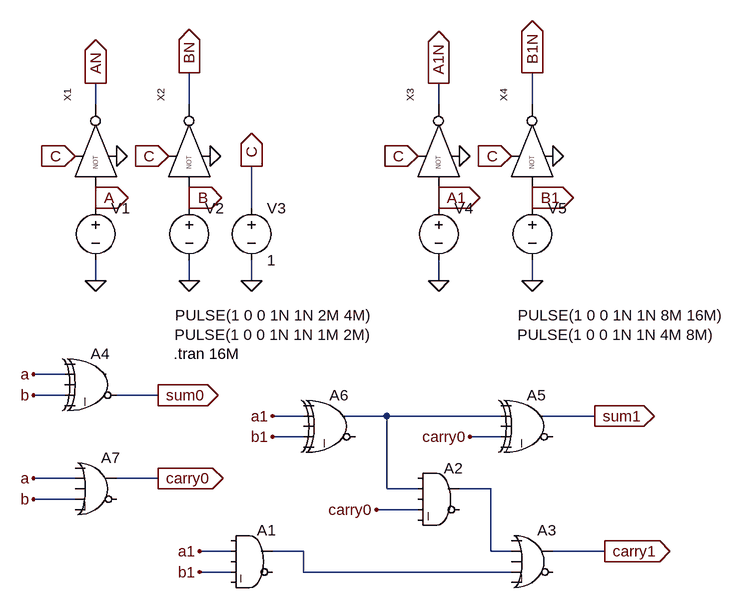
[diagram p0: schematic Draft41.asc]
Draft41.asc, the LTspice schematic file:
Version 4
SHEET 1 880 680
WIRE -208 -608 -208 -640
WIRE -64 -608 -64 -656
WIRE 320 -608 320 -640
WIRE 464 -608 464 -656
WIRE -208 -464 -208 -480
WIRE -64 -464 -64 -480
WIRE 320 -464 320 -480
WIRE 464 -464 464 -480
WIRE -208 -448 -208 -464
WIRE -64 -448 -64 -464
WIRE 32 -448 32 -512
WIRE 320 -448 320 -464
WIRE 464 -448 464 -464
WIRE -208 -336 -208 -368
WIRE -64 -336 -64 -368
WIRE 32 -336 32 -368
WIRE 320 -336 320 -368
WIRE 464 -336 464 -368
WIRE -256 -192 -304 -192
WIRE -256 -160 -304 -160
WIRE -112 -160 -176 -160
WIRE 112 -128 64 -128
WIRE 240 -128 176 -128
WIRE 416 -128 240 -128
WIRE 560 -128 480 -128
WIRE 112 -96 64 -96
WIRE 416 -96 368 -96
WIRE -240 -32 -304 -32
WIRE -112 -32 -176 -32
WIRE 240 -16 240 -128
WIRE 288 -16 240 -16
WIRE 400 -16 352 -16
WIRE -240 0 -304 0
WIRE 288 16 224 16
WIRE 0 80 -48 80
WIRE 112 80 64 80
WIRE 400 80 400 -16
WIRE 432 80 400 80
WIRE 576 80 496 80
WIRE 0 112 -48 112
WIRE 112 112 112 80
WIRE 432 112 112 112
FLAG 64 -128 a1
FLAG 64 -96 b1
FLAG 368 -96 carry0
FLAG 560 -128 sum1
IOPIN 560 -128 Out
FLAG -48 80 a1
FLAG -48 112 b1
FLAG 224 16 carry0
FLAG 576 80 carry1
IOPIN 576 80 Out
FLAG 32 -512 C
IOPIN 32 -512 Out
FLAG 32 -336 0
FLAG -64 -336 0
FLAG -208 -336 0
FLAG -32 -528 0
FLAG -176 -528 0
FLAG -208 -640 AN
IOPIN -208 -640 Out
FLAG -64 -656 BN
IOPIN -64 -656 Out
FLAG -96 -528 C
IOPIN -96 -528 In
FLAG -240 -528 C
IOPIN -240 -528 In
FLAG -208 -464 A
IOPIN -208 -464 Out
FLAG -64 -464 B
IOPIN -64 -464 Out
FLAG -304 -192 a
FLAG -304 -160 b
FLAG -304 -32 a
FLAG -304 0 b
FLAG -112 -32 carry0
IOPIN -112 -32 Out
FLAG -112 -160 sum0
IOPIN -112 -160 Out
FLAG 464 -336 0
FLAG 320 -336 0
FLAG 496 -528 0
FLAG 352 -528 0
FLAG 320 -640 A1N
IOPIN 320 -640 Out
FLAG 464 -656 B1N
IOPIN 464 -656 Out
FLAG 432 -528 C
IOPIN 432 -528 In
FLAG 288 -528 C
IOPIN 288 -528 In
FLAG 320 -464 A1
IOPIN 320 -464 Out
FLAG 464 -464 B1
IOPIN 464 -464 Out
SYMBOL Digital\\and 32 32 R0
SYMATTR InstName A1
SYMBOL Digital\\and 320 -64 R0
SYMATTR InstName A2
SYMBOL Digital\\or 464 32 R0
SYMATTR InstName A3
SYMBOL Digital\\xor 464 -176 R0
SYMATTR InstName A5
SYMBOL Digital\\xor 160 -176 R0
SYMATTR InstName A6
SYMBOL voltage -208 -464 R0
WINDOW 3 122 181 Left 2
WINDOW 123 0 0 Left 0
WINDOW 39 0 0 Left 0
SYMATTR Value PULSE(1 0 0 1N 1N 2M 4M)
SYMATTR InstName V1
SYMBOL voltage -64 -464 R0
WINDOW 3 -23 211 Left 2
WINDOW 123 0 0 Left 0
WINDOW 39 0 0 Left 0
SYMATTR Value PULSE(1 0 0 1N 1N 1M 2M)
SYMATTR InstName V2
SYMBOL voltage 32 -464 R0
WINDOW 123 0 0 Left 0
WINDOW 39 0 0 Left 0
SYMATTR InstName V3
SYMATTR Value 1
SYMBOL NOT4 -192 -544 R270
SYMATTR InstName X1
SYMBOL NOT4 -48 -544 R270
SYMATTR InstName X2
SYMBOL Digital\\xor -208 -240 R0
SYMATTR InstName A4
SYMBOL Digital\\or -208 -80 R0
SYMATTR InstName A7
SYMBOL voltage 320 -464 R0
WINDOW 3 122 181 Left 2
WINDOW 123 0 0 Left 0
WINDOW 39 0 0 Left 0
SYMATTR Value PULSE(1 0 0 1N 1N 8M 16M)
SYMATTR InstName V4
SYMBOL voltage 464 -464 R0
WINDOW 3 -23 211 Left 2
WINDOW 123 0 0 Left 0
WINDOW 39 0 0 Left 0
SYMATTR Value PULSE(1 0 0 1N 1N 4M 8M)
SYMATTR InstName V5
SYMBOL NOT4 336 -544 R270
SYMATTR InstName X3
SYMBOL NOT4 480 -544 R270
SYMATTR InstName X4
TEXT -88 -224 Left 2 !.tran 16M

The netlist it stands for:
* Draft41.asc
A1 0 a1 0 b1 0 0 N003 0 AND
A2 0 N001 0 carry0 0 0 N002 0 AND
A3 0 N002 0 N003 0 0 carry1 0 OR
A5 0 N001 0 carry0 0 0 sum1 0 XOR
A6 0 a1 0 b1 0 0 N001 0 XOR
V1 A 0 PULSE(1 0 0 1N 1N 2M 4M)
V2 B 0 PULSE(1 0 0 1N 1N 1M 2M)
V3 C 0 1
XX1 A C 0 AN NOT4  ; pins A VH VL OUT
XX2 B C 0 BN NOT4  ; pins A VH VL OUT
A4 0 A 0 B 0 sum0 0 0 XOR
A7 0 A 0 B 0 0 carry0 0 OR
V4 a1 0 PULSE(1 0 0 1N 1N 8M 16M)
V5 b1 0 PULSE(1 0 0 1N 1N 4M 8M)
XX3 a1 C 0 A1N NOT4  ; pins A VH VL OUT
XX4 b1 C 0 B1N NOT4  ; pins A VH VL OUT
.tran 16M
.backanno
.end